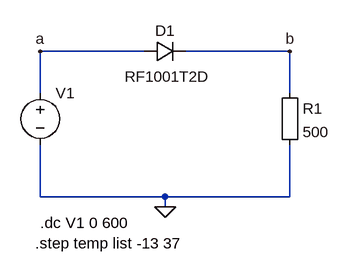
[diagram p0: schematic VA-F3-DEMO.asc]
VA-F3-DEMO.asc, the LTspice schematic file:
Version 4
SHEET 1 880 680
WIRE 16 128 -144 128
WIRE 240 128 80 128
WIRE -144 192 -144 128
WIRE 240 192 240 128
WIRE -144 352 -144 272
WIRE 48 352 -144 352
WIRE 240 352 240 272
WIRE 240 352 48 352
WIRE 48 368 48 352
FLAG -144 128 a
FLAG 240 128 b
FLAG 48 368 0
SYMBOL diode 16 144 R270
WINDOW 0 32 32 VTop 2
WINDOW 3 -7 36 VBottom 2
SYMATTR InstName D1
SYMATTR Value RF1001T2D
SYMBOL Misc\\EuropeanResistor 224 176 R0
SYMATTR InstName R1
SYMATTR Value 500
SYMBOL voltage -144 176 R0
WINDOW 3 24 96 Invisible 2
WINDOW 123 0 0 Left 2
WINDOW 39 0 0 Left 2
SYMATTR Value ""
SYMATTR InstName V1
TEXT -144 392 Left 2 !.dc V1 0 600
TEXT -152 424 Left 2 !.step temp list -13 37

The netlist it stands for:
* VA-F3-DEMO.asc
D1 a b RF1001T2D
R1 b 0 500
V1 a 0
.model D D
.lib standard.dio
.dc V1 0 600
.step temp list -13 37
.backanno
.end